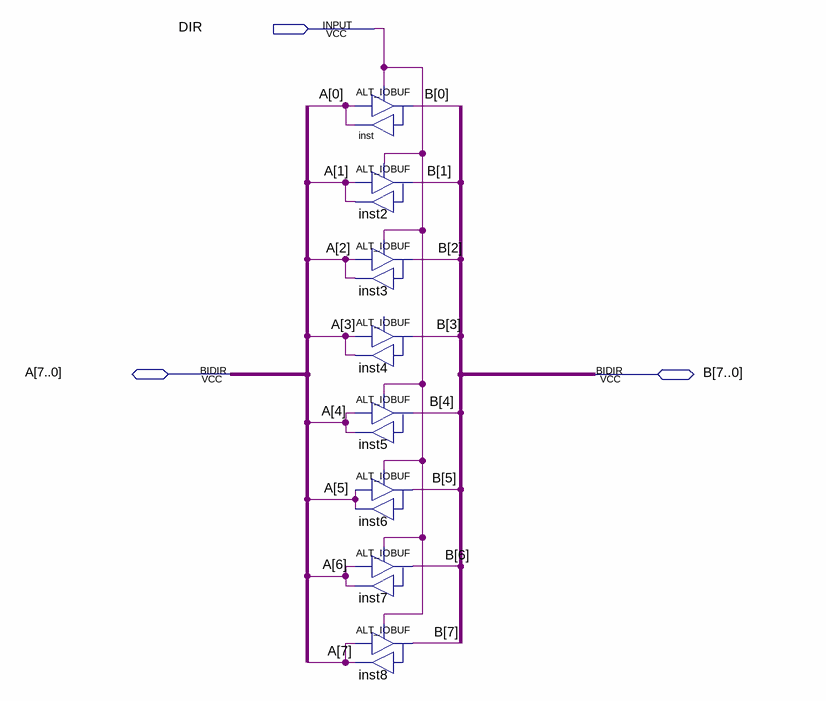
[diagram p0: schematic sheet]
// Quartus schematic bidir_buff_8.bdf as structural Verilog: 8 symbols, 3 pins
module bidir_buff_8 (
  input  DIR,
  inout  [7:0] A,
  inout  [7:0] B
);

  ALT_IOBUF inst (.i(A[0]), .oe(DIR), .o(A[0]), .io(B[0]));
  ALT_IOBUF inst2 (.i(A[1]), .oe(DIR), .o(A[1]), .io(B[1]));
  ALT_IOBUF inst3 (.i(A[2]), .oe(DIR), .o(A[2]), .io(B[2]));
  ALT_IOBUF inst4 (.i(A[3]), .o(A[3]), .io(B[3]));  // open: oe
  ALT_IOBUF inst5 (.i(A[4]), .oe(DIR), .o(A[4]), .io(B[4]));
  ALT_IOBUF inst6 (.i(A[5]), .oe(DIR), .o(A[5]), .io(B[5]));
  ALT_IOBUF inst7 (.i(A[6]), .oe(DIR), .o(A[6]), .io(B[6]));
  ALT_IOBUF inst8 (.i(A[7]), .oe(DIR), .o(A[7]), .io(B[7]));
endmodule
